# Altium schematic sheet teste2sch.SchDoc
size A4
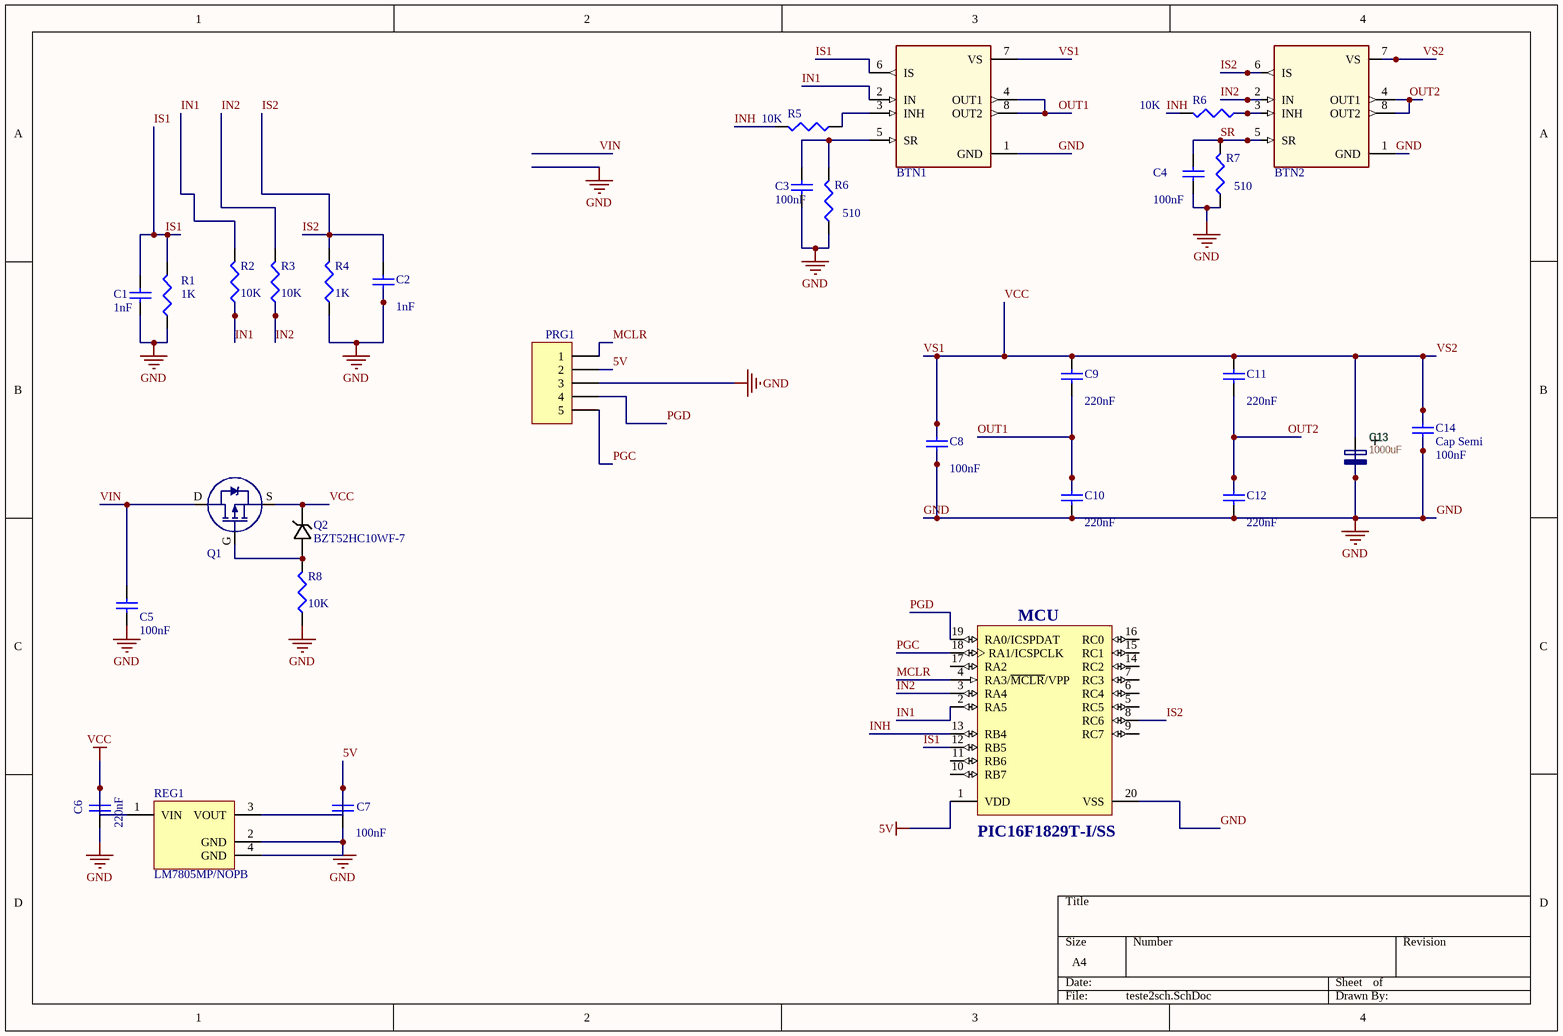
[diagram p0: teste2sch.SchDoc]

## Parts
(Parts that share a designator on the sheet are numbered #1, #2 ... from top to bottom, then left to right.)
BTN1  BTN8982TA  [TO127P1500X440-8N-1]  (value not drawn)
BTN2  BTN8982TA  [TO127P1500X440-8N-1]  (value not drawn)
C1  value 1nF  [1608[0603]]
C2  value 1nF  [1608[0603]]
C3  value 100nF  [1608[0603]]
C4  value 100nF  [1608[0603]]
C5  value 100nF  [1608[0603]]
C6  value 220nF  [C1206]  (hidden comment: Cap Semi)
C7  value 100nF  [C1206]
C8  value 100nF  [1608[0603]]
C9  value 220nF  [1608[0603]]
C10  value 220nF  [1608[0603]]
C11  value 220nF  [1608[0603]]
C12  value 220nF  [1608[0603]]
C13  1000uF  [CAPAE200P550X1200_FLAT1]
C14  Cap Semi  value 100nF  [1608[0603]]
MCU  PIC16F1829T-I/SS  [MCHP-SSOP-SS20_N]
PRG1  Header 5  [HDR1X5]  (value not drawn)
Q1  IPD50P04P4  [TO-252]  (value not drawn)
Q2  BZT52HC10WF-7  [SOD123]
R1  value 1K  [J1-0603]
R2  value 10K  [J1-0603]
R3  value 10K  [J1-0603]
R4  value 1K  [J1-0603]
R5  value 10K  [J1-0603]
R6#1  value 10K  [J1-0603]
R6#2  value 510  [J1-0603]
R7  value 510  [J1-0603]
R8  value 10K  [J1-0603]
REG1  LM7805MP/NOPB  [SOT223]

## Nets
5V: C7.1 MCU.1(VDD) PRG1.2 REG1.3(VOUT)
GND: BTN1.1(GND) BTN2.1(GND) C1.1 C2.1 C3.1 C4.1 C5.1 C6.1 C7.2 C8.1 C10.1 C12.1 C13.2 C14.1 MCU.20(VSS) PRG1.3 R1.1 R4.1 R6#2.1 R7.1 R8.1 REG1.2(GND) REG1.4(GND)
VCC: BTN1.7(VS) BTN2.7(VS) C6.2 C8.2 C9.2 C11.2 C13.1 C14.2 Q1.S Q2.K REG1.1(VIN)  [also labelled VS1, VS2]
IN1: BTN1.2(IN) MCU.2(RA5) R2.1 R2.2
IN2: BTN2.2(IN) MCU.3(RA4) R3.1 R3.2
INH: MCU.13(RB4) R5.2 R6#1.2
IS1: BTN1.6(IS) C1.2 MCU.12(RB5) R1.2
IS2: BTN2.6(IS) C2.2 MCU.8(RC6) R4.2
MCLR: MCU.4(RA3/~{MCLR}/VPP) PRG1.1
OUT1: BTN1.4(OUT1) BTN1.8(OUT2) C9.1 C10.2
OUT2: BTN2.4(OUT1) BTN2.8(OUT2) C11.1 C12.2
PGC: MCU.18(RA1/ICSPCLK) PRG1.5
PGD: MCU.19(RA0/ICSPDAT) PRG1.4
SR: BTN2.5(SR) C4.2 R7.2
VIN: C5.2 Q1.D
NetBTN1_3: BTN1.3(INH) R5.1
NetBTN1_5: BTN1.5(SR) C3.2 R6#2.2
NetBTN2_3: BTN2.3(INH) R6#1.1
NetQ1_G: Q1.G Q2.A R8.2

Not connected (* = marked no-connect by the designer): MCU 5(RC5) 6(RC4) 7(RC3) 9(RC7) 10(RB7) 11(RB6) 14(RC2) 15(RC1) 16(RC0) 17(RA2)

## Notes on the sheet
- (in symbol CP) +

## Library data of the parts
BTN1 BTN2 = BTN8982TA: High Current PN Half Bridge NovalithIC; Manufacturer: Infineon Technologies; ManufacturerPartNumber: BTN8982TA; PackageReference: PG-TO263-7-1
C1-C12 C14 = Cap Semi: Capacitor (Semiconductor SIM Model); Published: 8-Jun-2000; LatestRevisionDate: 29-May-2009; LatestRevisionNote: IPC-7351 Footprint Added.; PackageReference: C1206; Publisher: Altium Limited; PackageDescription: Chip Capacitor
C13 = CP
MCU = PIC16F1829T-I/SS: Flash Microcontroller with XLP Technology, 32 MHz, 17 I/O, -40 to 85 degC, 20-pin SSOP (SS20), Tape and Reel; Manufacturer: Microchip; # of A/D Channels: 12; Digital Communication: 1 -A/E/USART, 2 -MSSP(SPI/I2C); EEPROM Data Memory (bytes): 256; I/O Pins: 17; Internal Oscillator: 32 MHz, 31 kHz; Max. CPU Speed MHz: 32; Operation Voltage Range: 1.8V - 5.5V; Packing: T/R; Program Memory KBytes: 14; Program Memory KWords: 8; RAM: 1024; Timers: 4 - 8-bit, 1 - 16-bit; DatasheetVersion: Rev. C; PackageVersion: C04-072B, 12/2012; PackageReference: SSOP-SS20; PackageDescription: 20-Lead Plastic Shrink Small Outline, 5.3 x 7.2 mm Body, 0.65 mm Pitch; Supplier 1: Digi-Key; Supplier Part Number 1: PIC16F1829T-I/SS-ND; Supplier 2: Newark; Supplier Part Number 2: 82R4387; Supplier 3: Mouser; Supplier Part Number 3: 579-PIC16F1829T-I/SS; Memory Type: Flash; RoHS: TRUE; Mounting Technology: Surface Mount; PartNumber: PIC16F1829T-I/SS; ComponentLink1Description: Datasheet; ComponentLink1URL: http://ww1.microchip.com/downloads/en/DeviceDoc/41440C.pdf; ComponentLink2Description: Package Specification; ComponentLink2URL: http://www.microchip.com/stellent/groups/techpub_sg/documents/packagingspec/en012702.pdf; ComponentLink3Description: URL Link1; ComponentLink3URL: Product URL:http://www.microchip.com/datasheet/PIC16F1829
PRG1 = Header 5: Header, 5-Pin; LatestRevisionDate: 17-Jul-2002; LatestRevisionNote: Re-released for DXP Platform.; Publisher: Altium Limited
Q1 = IPD50P04P4: MOSFET P-Ch -40V -50A DPAK-2 OptiMOS-P2; pin to pad: D>4 G>1 S>3
Q2 = BZT52HC10WF-7: Diode Zener 10.6V 375 mW AEC-Q101
R1-R5 R6#1 R6#2 R7 R8 = Res3: Resistor; Published: 8-Jun-2000; LatestRevisionDate: 29-May-2009; LatestRevisionNote: IPC-7351 Footprint Added.; PackageReference: J1-0603; Publisher: Altium Limited; PackageDescription: Chip Resistor
REG1 = LM7805MP/NOPB: 5V Regulator, 3-Pin SOT-223, Extended Temperature, Tape and Reel; Published: 29-Jan-2009; DatasheetVersion: revA, Aug-2007; PackageVersion: revBB, Aug-2009; PackageReference: SOT-223-DB3; Publisher: Altium Limited; PackageDescription: 3-Lead Plastic Small Outline Transistor (DB) [SOT-223]; Supplier 1: Digi-Key; Supplier Part Number 1: MCP1824ST-1202E/DBTR-ND; Supplier 2: Digi-Key; Supplier Part Number 2: MCP1824ST-1202E/DBCT-ND; Supplier 3: Digi-Key; Supplier Part Number 3: MCP1824ST-1202E/DBDKR-ND; Supplier 4: Farnell; Supplier Part Number 4: 1675417; ComponentLink1Description: Datasheet; ComponentLink1URL: http://ww1.microchip.com/downloads/en/DeviceDoc/22070a.pdf; ComponentLink2Description: Packaging Specification; ComponentLink2URL: http://www.microchip.com/stellent/groups/techpub_sg/documents/packagingspec/en012702.pdf; ComponentLink3Description: Microchip.com Home; ComponentLink3URL: http://www.microchip.com/